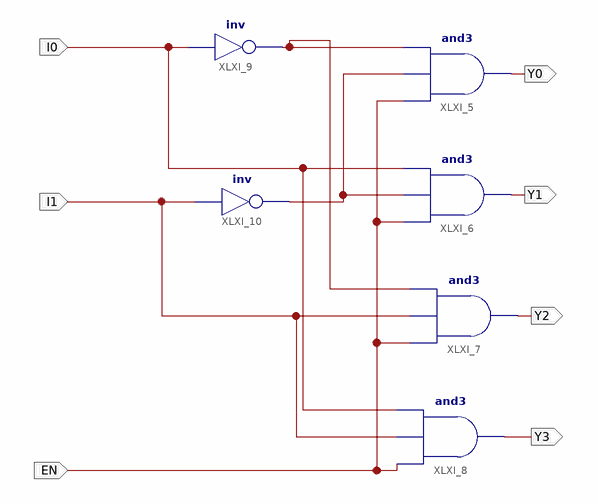
[diagram p0: schematic sheet 1]
// Xilinx ISE schematic Decoder_2_to_4.sch (spartan3e) as structural Verilog: 6 symbols, 7 ports
module Decoder_2_to_4 (
  input  I0,
  input  I1,
  input  EN,
  output Y0,
  output Y1,
  output Y2,
  output Y3
);

  wire XLXN_2, XLXN_15;

  and XLXI_5 (Y0, EN, XLXN_2, XLXN_15);
  and XLXI_6 (Y1, EN, XLXN_2, I0);
  and XLXI_7 (Y2, EN, I1, XLXN_15);
  and XLXI_8 (Y3, EN, I1, I0);
  not XLXI_9 (XLXN_15, I0);
  not XLXI_10 (XLXN_2, I1);
endmodule
